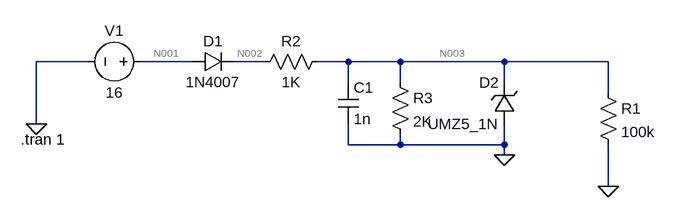
[diagram p0: schematic Zener.asc]
Zener.asc, the LTspice schematic file:
Version 4.1
SHEET 1 944 680
WIRE 64 144 -16 144
WIRE 224 144 144 144
WIRE 336 144 288 144
WIRE 464 144 416 144
WIRE 544 144 464 144
WIRE 704 144 544 144
WIRE 864 144 704 144
WIRE 464 176 464 144
WIRE 544 176 544 144
WIRE 704 176 704 144
WIRE 864 192 864 144
WIRE -16 240 -16 144
WIRE 464 272 464 240
WIRE 544 272 544 256
WIRE 544 272 464 272
WIRE 704 272 704 240
WIRE 704 272 544 272
WIRE 704 288 704 272
WIRE 864 336 864 272
FLAG -16 240 0
FLAG 704 288 0
FLAG 864 336 0
SYMBOL voltage 160 144 R90
WINDOW 0 -32 56 VBottom 2
WINDOW 3 32 56 VTop 2
WINDOW 123 0 0 Left 0
WINDOW 39 0 0 Left 0
SYMATTR InstName V1
SYMATTR Value 16
SYMBOL diode 224 160 R270
WINDOW 0 32 32 VTop 2
WINDOW 3 0 32 VBottom 2
SYMATTR InstName D1
SYMATTR Value 1N4007
SYMBOL zener 720 240 R180
WINDOW 0 24 64 Left 2
WINDOW 3 24 0 Left 2
SYMATTR InstName D2
SYMATTR Value UMZ5_1N
SYMBOL res 848 176 R0
SYMATTR InstName R1
SYMATTR Value 100k
SYMBOL res 528 160 R0
SYMATTR InstName R3
SYMATTR Value 2K
SYMBOL cap 448 176 R0
SYMATTR InstName C1
SYMATTR Value 1n
SYMBOL res 432 128 R90
WINDOW 0 0 56 VBottom 2
WINDOW 3 32 56 VTop 2
SYMATTR InstName R2
SYMATTR Value 1K
TEXT -40 264 Left 2 !.tran 1

The netlist it stands for:
* Zener.asc
V1 N001 0 16
D1 N001 N002 1N4007
D2 0 N003 UMZ5_1N
R1 N003 0 100k
R3 N003 0 2K
C1 N003 0 1n
R2 N003 N002 1K
.model D D
.lib standard.dio
.tran 1
.backanno
.end

* Results of the author's LTspice run, read from the files saved beside the schematic
* Operating Point, zero values left out:
*   V(n002) = 15.33 V
*   V(n001) = 16 V
*   V(n003) = 5.095 V
*   I(V1) = -10.23 mA
*   I(R3) = 2.547 mA
*   I(D2) = -7.635 mA
*   I(R2) = -10.23 mA
*   I(D1) = 10.23 mA
*   I(R1) = 50.95 µA